# Altium schematic sheet INT_mPCIeX2_SIM.SchDoc
size 420 x 297 mm; Scale: 1:1; DocumentType: Схема электрическая принципиальная; SheetNumber: 25; SheetTotal: 32; DocumentTypeShort: Э3; DocumentInvertoryNumber: ㅤ
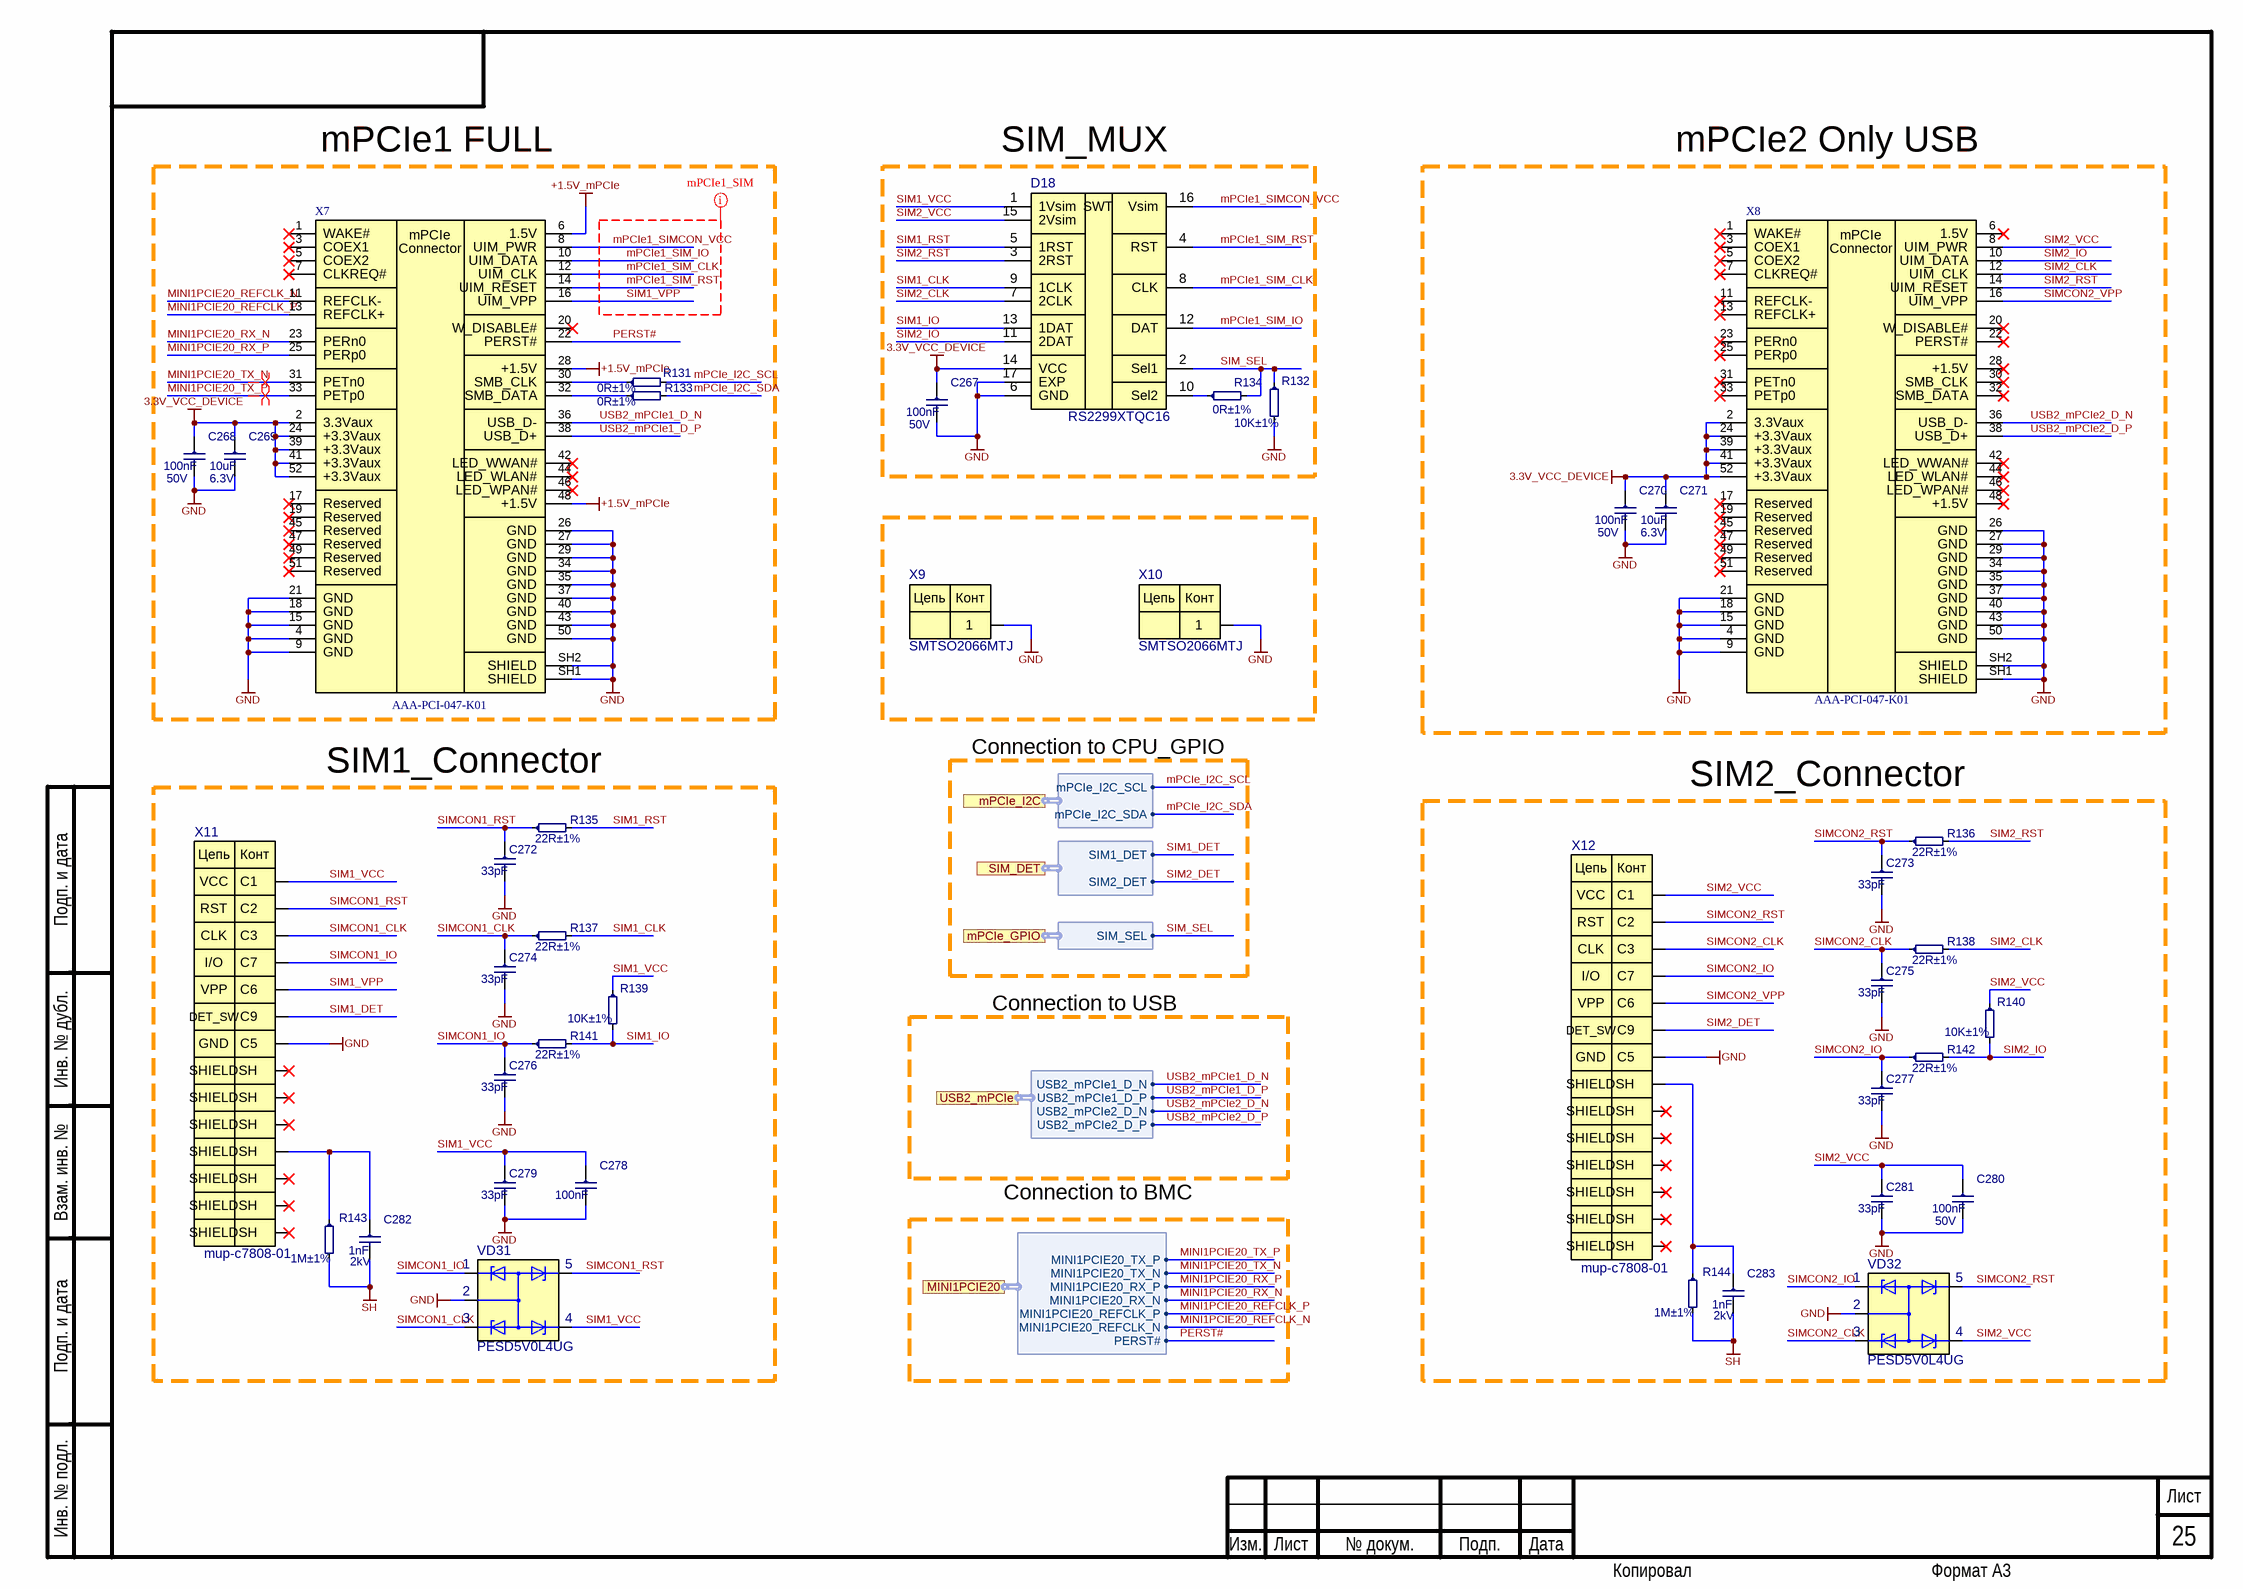
[diagram p0: INT_mPCIeX2_SIM.SchDoc]

## Parts
C267  100nF  Voltage: 50V  [C0402]
C268  100nF  Voltage: 50V  [C0402]
C269  10uF  Voltage: 6.3V  [C0402]
C270  100nF  Voltage: 50V  [C0402]
C271  10uF  Voltage: 6.3V  [C0402]
C272  33pF  [C0402]
C273  33pF  [C0402]
C274  33pF  [C0402]
C275  33pF  [C0402]
C276  33pF  [C0402]
C277  33pF  [C0402]
C278  100nF  [C0402]
C279  33pF  [C0402]
C280  100nF  Voltage: 50V  [C0402]
C281  33pF  [C0402]
C282  1nF  Voltage: 2kV  [C1812]
C283  1nF  Voltage: 2kV  [C1812]
D18  RS2299XTQC16  [RS2299XTQC16]
R131  0R±1%  [R0402]
R132  10K±1%  [R0402]
R133  0R±1%  [R0402]
R134  0R±1%  [R0402]
R135  22R±1%  [R0402]
R136  22R±1%  [R0402]
R137  22R±1%  [R0402]
R138  22R±1%  [R0402]
R139  10K±1%  [R0402]
R140  10K±1%  [R0402]
R141  22R±1%  [R0402]
R142  22R±1%  [R0402]
R143  1M±1%  [R1206]
R144  1M±1%  [R1206]
VD31  PESD5V0L4UG  [TSSOP5-5]
VD32  PESD5V0L4UG  [TSSOP5-5]
X7  AAA-PCI-047-K01  [AAA-PCI-047-K01]
X8  AAA-PCI-047-K01  [AAA-PCI-047-K01]
X9  SMTSO2066MTJ  [SMTSO2066MTJ]
X10  SMTSO2066MTJ  [SMTSO2066MTJ]
X11  mup-c7808-01  [mup-c7808]
X12  mup-c7808-01  [mup-c7808]

## Ports
MINI1PCIE20 (harness MINI1PCIE20), mPCIe_GPIO (harness mPCIe_GPIO), mPCIe_I2C (harness mPCIe_I2C), SIM_DET (harness SIM_DET), USB2_mPCIe (harness USB2_mPCIe)

## Harnesses
mPCIe_GPIO: SIM_SEL
SIM_DET: SIM1_DET, SIM2_DET
mPCIe_I2C: mPCIe_I2C_SDA, mPCIe_I2C_SCL
USB2_mPCIe: USB2_mPCIe1_D_P, USB2_mPCIe1_D_N, USB2_mPCIe2_D_P, USB2_mPCIe2_D_N
MINI1PCIE20: MINI1PCIE20_TX_N, MINI1PCIE20_RX_P, MINI1PCIE20_RX_N, MINI1PCIE20_TX_P, MINI1PCIE20_REFCLK_P, MINI1PCIE20_REFCLK_N, PERST#

## Nets
3.3V_VCC_DEVICE: C267.1 C268.1 C269.1 C270.1 C271.1 D18.14(VCC) X7.2(3.3Vaux) X7.24(+3.3Vaux) X7.39(+3.3Vaux) X7.41(+3.3Vaux) X7.52(+3.3Vaux) X8.2(3.3Vaux) X8.24(+3.3Vaux) X8.39(+3.3Vaux) X8.41(+3.3Vaux) X8.52(+3.3Vaux)
+1.5V_mPCIe: X7.6(1.5V) X7.28(+1.5V) X7.48(+1.5V)
GND: C267.2 C268.2 C269.2 C270.2 C271.2 C272.2 C273.2 C274.2 C275.2 C276.2 C277.2 C278.2 C279.2 C280.2 C281.2 D18.6(GND) D18.17(EXP) R132.2 VD31.2 VD32.2 X7.4(GND) X7.9(GND) X7.15(GND) X7.18(GND) X7.21(GND) X7.26(GND) X7.27(GND) X7.29(GND) X7.34(GND) X7.35(GND) X7.37(GND) X7.40(GND) X7.43(GND) X7.50(GND) X7.SH1(SHIELD) X7.SH2(SHIELD) X8.4(GND) X8.9(GND) X8.15(GND) X8.18(GND) X8.21(GND) X8.26(GND) X8.27(GND) X8.29(GND) X8.34(GND) X8.35(GND) X8.37(GND) X8.40(GND) X8.43(GND) X8.50(GND) X8.SH1(SHIELD) X8.SH2(SHIELD) X9.1 X10.1 X11.C5 X12.C5
SH: C282.2 C283.2 R143.2 R144.2
MINI1PCIE20_REFCLK_N: X7.11(REFCLK-) ; port MINI1PCIE20.MINI1PCIE20_REFCLK_N
MINI1PCIE20_REFCLK_P: X7.13(REFCLK+) ; port MINI1PCIE20.MINI1PCIE20_REFCLK_P
MINI1PCIE20_RX_N: X7.23(PERn0) ; port MINI1PCIE20.MINI1PCIE20_RX_N
MINI1PCIE20_RX_P: X7.25(PERp0) ; port MINI1PCIE20.MINI1PCIE20_RX_P
MINI1PCIE20_TX_N: X7.31(PETn0) ; port MINI1PCIE20.MINI1PCIE20_TX_N
MINI1PCIE20_TX_P: X7.33(РЕТр0) ; port MINI1PCIE20.MINI1PCIE20_TX_P
mPCIe1_SIM_CLK: D18.8(CLK) X7.12(UIM_CLK)
mPCIe1_SIM_IO: D18.12(DAT) X7.10(UIM_DATA)
mPCIe1_SIM_RST: D18.4(RST) X7.14(UIM_RESET)
mPCIe1_SIMCON_VCC: D18.16(Vsim) X7.8(UIM_PWR)
mPCIe_I2C_SCL: R131.2 ; port mPCIe_I2C.mPCIe_I2C_SCL
mPCIe_I2C_SDA: R133.2 ; port mPCIe_I2C.mPCIe_I2C_SDA
PERST#: X7.22(PERST#) ; port MINI1PCIE20.PERST#
SIM1_CLK: D18.9(1CLK) R137.2
SIM1_DET: X11.C9 ; port SIM_DET.SIM1_DET
SIM1_IO: D18.13(1DAT) R139.2 R141.2
SIM1_RST: D18.5(1RST) R135.2
SIM1_VCC: C278.1 C279.1 D18.1(1Vsim) R139.1 VD31.4 X11.C1
SIM1_VPP: X7.16(UIM_VPP) X11.C6
SIM2_CLK: D18.7(2CLK) R138.2 X8.12(UIM_CLK)
SIM2_DET: X12.C9 ; port SIM_DET.SIM2_DET
SIM2_IO: D18.11(2DAT) R140.2 R142.2 X8.10(UIM_DATA)
SIM2_RST: D18.3(2RST) R136.2 X8.14(UIM_RESET)
SIM2_VCC: C280.1 C281.1 D18.15(2Vsim) R140.1 VD32.4 X8.8(UIM_PWR) X12.C1
SIM_SEL: D18.2(Sel1) R132.1 R134.2 ; port mPCIe_GPIO.SIM_SEL
SIMCON1_CLK: C274.1 R137.1 VD31.3 X11.C3
SIMCON1_IO: C276.1 R141.1 VD31.1 X11.C7
SIMCON1_RST: C272.1 R135.1 VD31.5 X11.C2
SIMCON2_CLK: C275.1 R138.1 VD32.3 X12.C3
SIMCON2_IO: C277.1 R142.1 VD32.1 X12.C7
SIMCON2_RST: C273.1 R136.1 VD32.5 X12.C2
SIMCON2_VPP: X8.16(UIM_VPP) X12.C6
USB2_mPCIe1_D_N: X7.36(USB_D-) ; port USB2_mPCIe.USB2_mPCIe1_D_N
USB2_mPCIe1_D_P: X7.38(USB_D+) ; port USB2_mPCIe.USB2_mPCIe1_D_P
USB2_mPCIe2_D_N: X8.36(USB_D-) ; port USB2_mPCIe.USB2_mPCIe2_D_N
USB2_mPCIe2_D_P: X8.38(USB_D+) ; port USB2_mPCIe.USB2_mPCIe2_D_P
NetC282_1: C282.1 R143.1 X11.SH4(SH)
NetC283_1: C283.1 R144.1 X12.SH1(SH)
NetD18_10: D18.10(Sel2) R134.1
NetR131_1: R131.1 X7.30(SMB_CLK)
NetR133_1: R133.1 X7.32(SMB_DATA)

Not connected (* = marked no-connect by the designer): X7 1(WAKE#)* 3(СОЕХ1)* 5(СОЕХ2)* 7(CLKREQ#)* 17(Reserved)* 19(Reserved)* 20(W_DISABLE#)* 42(LED_WWAN#)* 44(LED_WLAN#)* 45(Reserved)* 46(LED_WPAN#)* 47(Reserved)* 49(Reserved)* 51(Reserved)*; X8 1(WAKE#)* 3(СОЕХ1)* 5(СОЕХ2)* 6(1.5V)* 7(CLKREQ#)* 11(REFCLK-)* 13(REFCLK+)* 17(Reserved)* 19(Reserved)* 20(W_DISABLE#)* 22(PERST#)* 23(PERn0)* 25(PERp0)* 28(+1.5V)* 30(SMB_CLK)* 31(PETn0)* 32(SMB_DATA)* 33(РЕТр0)* 42(LED_WWAN#)* 44(LED_WLAN#)* 45(Reserved)* 46(LED_WPAN#)* 47(Reserved)* 48(+1.5V)* 49(Reserved)* 51(Reserved)*; X11 SH1(SH)* SH2(SH)* SH3(SH)* SH5(SH)* SH6(SH)* SH7(SH)*; X12 SH2(SH)* SH3(SH)* SH4(SH)* SH5(SH)* SH6(SH)* SH7(SH)*

## Layout directives
net class mPCIe1_SIM: mPCIe1_SIM_CLK, mPCIe1_SIM_IO, mPCIe1_SIM_RST, mPCIe1_SIMCON_VCC, SIM1_VPP
differential pair; differential pair class Diff_Z85: MINI1PCIE20_TX_N, MINI1PCIE20_TX_P

## Notes on the sheet
- mPCIe1 FULL
- (near D18) SIM_MUX
- mPCIe2 Only USB
- SIM1_Connector
- Connection to CPU_GPIO
- SIM2_Connector
- Connection to USB
- Connection to BMC
- Подп. и дата
- Инв. № дубл.
- Взам. инв. №
- Инв. № подл.
- Изм.
- Лист
- № докум.
- Подп.
- Дата
- Копировал
- Формат А3
- (in symbol AAA-PCI-047-K01) mPCIe; Connector
- (in symbol mup-c7808) Цепь; Конт; VCC; RST; CLK; I/O; VPP; DET_SW; GND; SHIELD
- (in symbol RS2299XTQC16) SWT
- (in symbol SMTSO2066MTJ) Цепь; Конт

## Library data of the parts
C267 C268 C270 C278 C280 = 0402-X7R-50V-0.1uF±10%: Ceramic Capacitor 0402 100nF ±10% 50V X7R; Manufacturer: Yageo; NameFromManufacturer: CC0402KRX7R9BB104; Place: *); Check: False; Dielectric: X7R; Case: C0402; Part Number: 0402-X7R-50V-0.1uF±10%; Value: 100nF; Tolerance: 10%; Temperature: -55°C~125°C; ComponentLink2Description: Link to datasheet; ComponentLink1Description: DATASHEET; ComponentLink2URL: https://www.lcsc.com/product-detail/Multilayer-Ceramic-Capacitors-MLCC-SMD-SMT_YAGEO-CC0402KRX7R9BB104_C131394.html; Last changed: 09.04.2025
  C278: Voltage: 50V
C269 C271 = 0402-X5R-6.3V-10uF±20%: Manufacturer: Yageo; NameFromManufacturer: CC0402MRX5R5BB106; Dielectric: X5R; Place: *); Tolerance: 20%; Check: False; Case: C0402; Part Number: 0402-X5R-6.3V-10uF±20%; Value: 10uF; Temperature: -55°C~125°C; ComponentLink2Description: Link to datasheet; ComponentLink1Description: DATASHEET; ComponentLink2URL: https://ru.mouser.com/ProductDetail/YAGEO/CC0402MRX5R5BB106?qs=%2Fha2pyFadujQAk9rG2cgJj8l7IbODD3KVaDjvxAcKzu9LtlLnRlq6Q%3D%3D; ComponentLink1URL: Datasheets/capacitors/UPY-GPHC_X5R_4V-to-50V_27.pdf; Last changed: 27.10.2022
C272-C277 C279 C281 = 0402-NP0-50V-33pF±5%: Manufacturer: Yageo; NameFromManufacturer: CC0402FRNPO9BN330; Dielectric: NP0; Voltage: 50V; Place: *); Tolerance: 5%; Check: False; Case: C0402; Part Number: 0402-NP0-50V-33pF±5%; Value: 33pF; Temperature: -55°C~125°C; ComponentLink2Description: Link to datasheet; ComponentLink1Description: DATASHEET; ComponentLink2URL: https://www.terraelectronica.ru/pdf/show?pdf_file=http%253A%252F%252Fwww.farnell.com%252Fdatasheets%252F2710587.pdf; ComponentLink1URL: Datasheets/capacitors/DOC012633270.pdf; Last changed: 27.10.2022
C282 C283 = 1812-C0G-2kV-1uF±10%: *; Part Number: 1812-C0G-2kV-1nF±10%; Manufacturer: FH; NameFromManufacturer: 1812B102K202NT; Dielectric: C0G; Place: *); Tolerance: 5%; Check: False; Case: CASE; Value: 1nF; Temperature: -55°C~125°C; ComponentLink2Description: Link to datasheet; ComponentLink1Description: DATASHEET; ComponentLink2URL: https://octopart.com/1812ga102jat2a-avx-75165070?r=sp; ComponentLink1URL: Datasheets/capacitors/C0GNP0-Dielectric.pdf; Last changed: 27.10.2022
D18 = RS2299XTQC16: Analog Switches; Manufacturer: RUNIC Tech; Check: False; Part Number: RS2299XTQC16; Value: RS2299XTQC16; NameFromManufacturer: RS2299XTQC16
R131 R133 R134 = 0402-0.0625W-0R-100ppm±1%: Chip Resistor 0402 0Ω ±1% 50V ±100ppm/℃ Thick Film; NameFromManufacturer: RC0402FR-070RL; Manufacturer: Yageo; Place: *); Value: 0R; Check: False; Case: R0402; Part Number: 0402-0.0625W-0R-100ppm±1%; Tolerance: 1%; Temperature: -55°C~155°C; ComponentLink1Description: DATASHEET; ComponentLink1URL: https://www.chipdip.ru/product0/8000617426?ysclid=l7og5x0plo427794326; Datasheet: Datasheets/resistors/DOC012445956.pdf; Last changed: 27.10.2022
R132 R139 R140 = 0402-0.0625W-10K-100ppm±1%: Chip Resistor 0402 10kΩ ±1% 50V ±100ppm/℃ Thick Film; NameFromManufacturer: RC0402FR-0710KL; Manufacturer: Yageo; Place: *); Value: 10K; Check: False; Case: R0402; Part Number: 0402-0.0625W-10K-100ppm±1%; Tolerance: 1%; Temperature: -55°C~155°C; ComponentLink1Description: DATASHEET; ComponentLink1URL: https://ru.mouser.com/ProductDetail/YAGEO/RC0402FR-0710KL?qs=%2Fha2pyFaduhjtLcYvKXQ8IogF7YwN7YtH%252BOO8ZtEEMnoa4yoWYcwpw%3D%3D; Datasheet: Datasheets/resistors/PYu-RC_Group_51_RoHS_L_11.pdf; Last changed: 27.10.2022
R135-R138 R141 R142 = 0402-0.0625W-22R-100ppm±1%: Chip Resistor 0402 22Ω ±1% 50V ±100ppm/℃ Thick Film; NameFromManufacturer: RC0402FR-0722RL; Manufacturer: Yageo; Place: *); Value: 22R; Check: False; Case: R0402; Part Number: 0402-0.0625W-22R-100ppm±1%; Tolerance: 1%; Temperature: -55°C~155°C; ComponentLink1Description: DATASHEET; ComponentLink1URL: https://www.yageo.com/upload/media/product/productsearch/datasheet/rchip/PYu-RC_Group_51_RoHS_L_11.pdf; Datasheet: Datasheets/resistors/PYu-RC_Group_51_RoHS_L_11.pdf; Last changed: 27.10.2022
R143 R144 = 1206-0.25W-1M-100ppm±1%: Chip Resistor 1206 1MΩ ±1% 200V ±100ppm/℃ Thick Film; NameFromManufacturer: RC1206FR-071ML; Manufacturer: Yageo; Place: *); Value: 1M; Check: False; Case: R1206; Part Number: 1206-0.25W-1M-100ppm±1%; Tolerance: 1%; Temperature: -55°C~155°C; ComponentLink1Description: DATASHEET; ComponentLink1URL: https://www.lcsc.com/product-detail/Chip-Resistor-Surface-Mount_YAGEO-RC1206FR-071ML_C108083.html?s_z=n_RC1206FR-071ML; Last changed: 09.04.2025
VD31 VD32 = PESD5V0L4UG,115: Low capacitance unidirectional quadruple ESD protectiondiode arrays; Manufacturer: Tech Public Co.; Place: S; Check: False; Part Number: PESD5V0L4UG; Value: PESD5V0L4UG; Temperature: -65°C~150°C; ComponentLink1Description: DATASHEET; NameFromManufacturer: PESD5V0L4UG; ComponentLink1URL: https://ru.mouser.com/datasheet/2/916/PESDXL4UF_G_W-1599806.pdf; Last changed: 09.08.2021
  VD32: Datasheet: #https://ru.mouser.com/datasheet/2/916/PESDXL4UF_G_W-1599806.pdf#
X7 X8 = AAA-PCI-047-K01: mPCI-E Surface Mount 52 SMD,P=0.8mm Card Edge Connectors; Manufacturer: LOTES; Place: S; Check: False; Value: AAA-PCI-047-K01; Part Number: AAA-PCI-047-K01; NameFromManufacturer: AAA-PCI-047-K01; ComponentLink1Description: DATASHEET; Last changed: 24.03.2023
X9 X10 = SMTSO2066MTJ: Manufacturer: Sinhoo; Check: False; Part Number: SMTSO2066MTJ; Value: SMTSO2066MTJ; NameFromManufacturer: SMTSO2066MTJ
X11 X12 = mup-c7808: Manufacturer: MUP; Check: False; Part Number: mup-c7808-01; Value: mup-c7808-01; NameFromManufacturer: mup-c7808-01